# EAGLE schematic ds1307 (EAGLE 6.0)
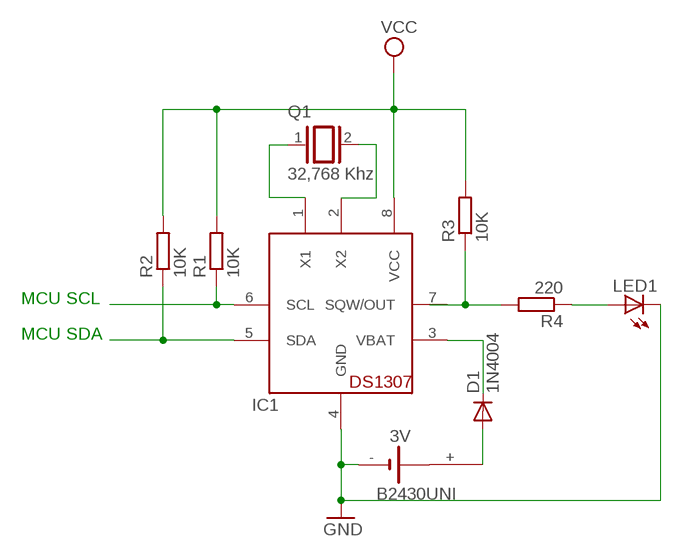
[diagram p0: schematic, sheet 1]

## Parts
3V  B2430UNI  [B2430UNI]
D1  1N4004  [DO41-10]
IC1  DS1307  [DIL08]
LED1  LED5MM  [LED5MM]
Q1  32,768 Khz  XTAL  [Q]
R1  10K  R-EU_0204/7  [0204/7]
R2  10K  R-EU_0204/7  [0204/7]
R3  10K  R-EU_0204/7  [0204/7]
R4  220  R-EU_0204/7  [0204/7]

## Nets
GND: 3V.- IC1.4(GND) LED1.K(C)
N$1: IC1.1(X1) Q1.1
N$2: IC1.2(X2) Q1.2
N$3: IC1.6(SCL) R1.1
N$4: IC1.5(SDA) R2.1
N$5: 3V.+ D1.A
N$6: R3.1 R4.2
N$7: LED1.A R4.1
N$8: D1.C IC1.3(VBAT)
VCC: IC1.8(VCC) R1.2 R2.2 R3.2
Unconnected: 3V.+@1(+) 3V.+@2(+) 3V.+@3(+) 3V.+@4(+) 3V.-@1(-) IC1.7(SQW/OUT)

## Notes on the sheet
- MCU SCL
- MCU SDA

## Library data of the parts
3V = battery:B2430UNI: LI BATTERY
D1 = adafruit:1N4004: DIODE General purpose 1N400x type rectifier (With bigger pads) http://www.ladyada.net/library/pcb/eaglelibrary.html
IC1 = adafruit:DS1307: DS1307 Real time clock (RTC) with battery backup ability. Talk to it via i2c
LED1 = adafruit:LED: LED OSRAM: - CHIPLED LG R971, LG N971, LY N971, LG Q971, LY Q971, LO R971, LY R971 LH N974, LH R974 LS Q976, LO Q976, LY Q976 LO Q996 - Hyper CHIPLED LW Q18S LB Q993, LB Q99A, LB R99A - SideLED LS A670, LO A670, LY A670, LG A670, LP A670 LB A673, LV A673, LT A673, LW A673 LH A674 LY A675 LS A676, LA A676, LO A676, LY A676, LW A676 LS A679, LY A679, LG A679 - Hyper Micro SIDELED® LS Y876, LA Y876, LO Y876, LY Y876 LT Y87S - SmartLED LW L88C, LW L88S LB L89C, LB L89S, LG L890 LS L89K, LO L89K, LY L89K LS L896, LA L896, LO L896, LY L896 - TOPLED LS T670, LO T670, LY T670, LG T670, LP T670 LSG T670, LSP T670, LSY T670, LOP T670, LYG T670 LG T671, LOG T671, LSG T671 LB T673, LV T673, LT T673, LW T673 LH T674 LS T676, LA T676, LO T676, LY T676, LB T676, LH T676, LSB T676, LW T676 LB T67C, LV T67C, LT T67C, LS T67K, LO T67K, LY T67K, LW E67C LS E67B, LA E67B, LO E67B, LY E67B, LB E67C, LV E67C, LT E67C LW T67C LS T679, LY T679, LG T679 LS T770, LO T770, LY T770, LG T770, LP T770 LB T773, LV T773, LT T773, LW T773 LH T774 LS E675, LA E675, LY E675, LS T675 LS T776, LA T776, LO T776, LY T776, LB T776 LHGB T686 LT T68C, LB T68C - Hyper Mini TOPLED® LB M676 - Mini TOPLED Santana® LG M470 LS M47K, LO M47K, LY M47K Source: http://www.osram.convergy.de/
Q1 = special:XTAL: CRYSTAL
R1-R4 = rcl:R-EU_: RESISTOR, European symbol